# EAGLE design RGBClock (EAGLE 6.5.0)
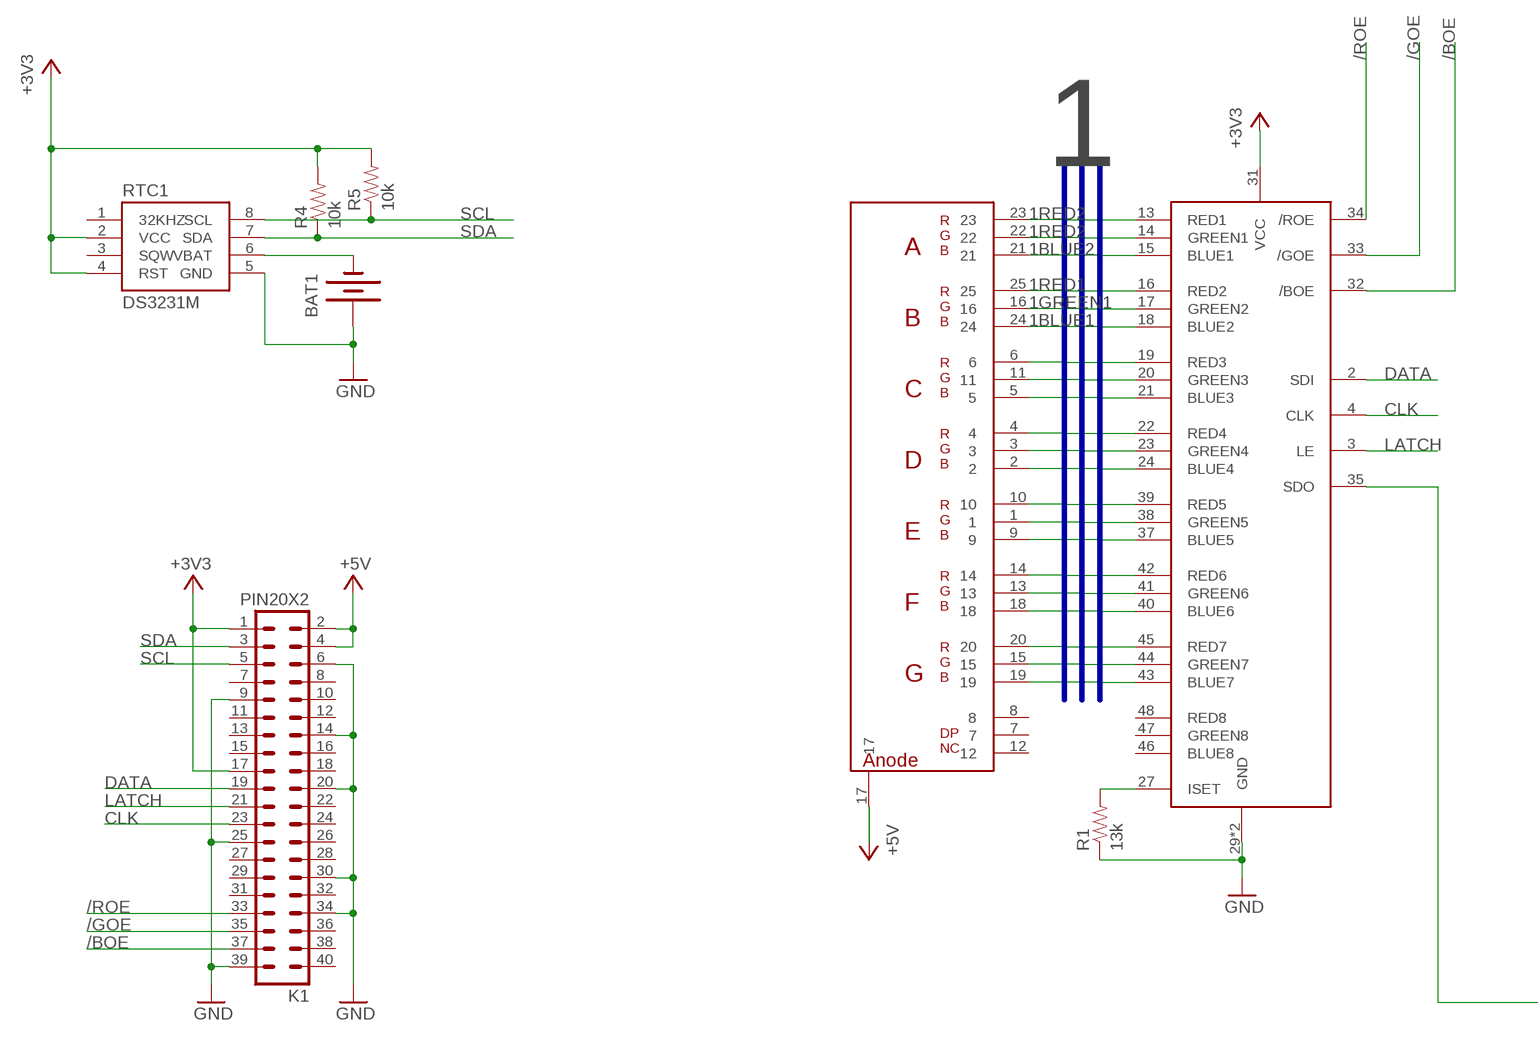
[diagram p0: schematic, sheet 1, part 1 of 2]
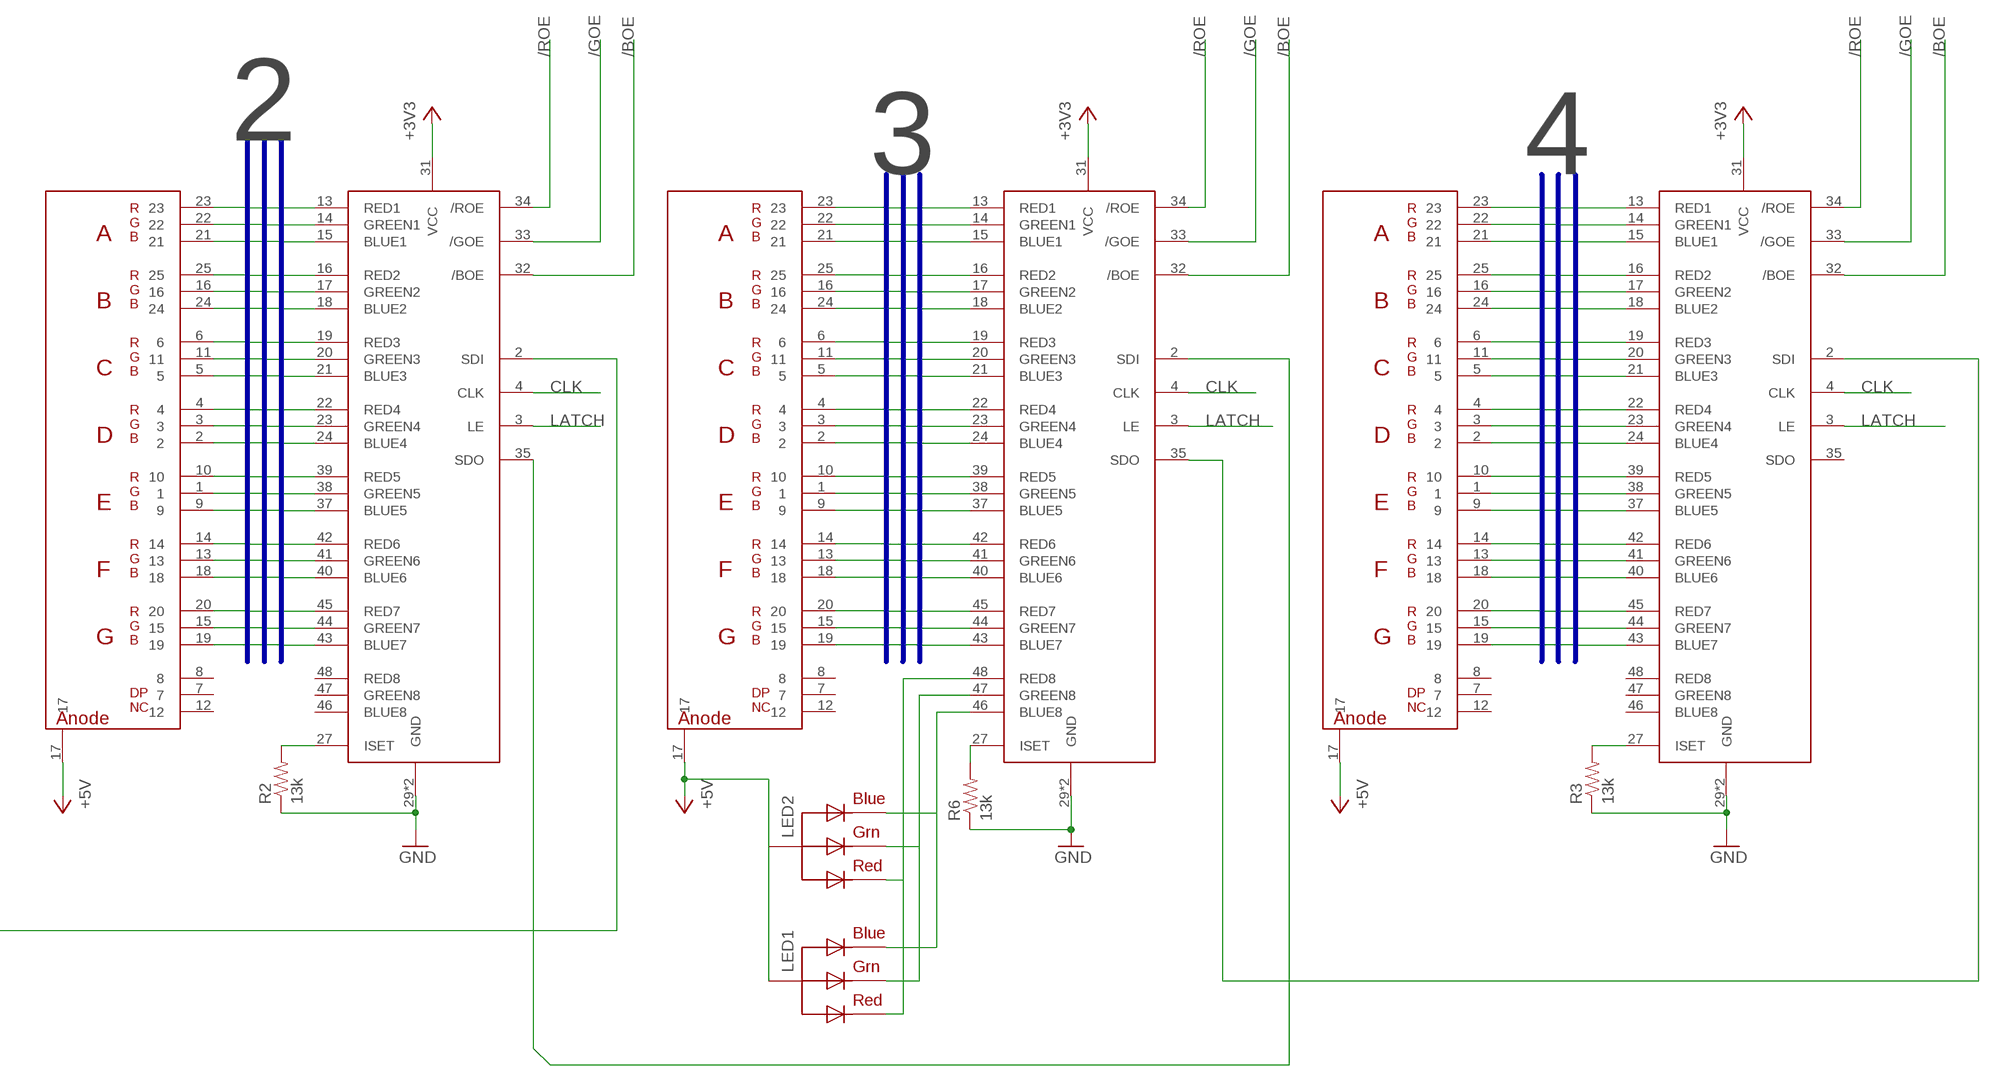
[diagram p1: schematic, sheet 1, part 2 of 2]

## Parts
BAT1  BATTERY12MM  [BATTCON_12MM]
K1  PIN20X2  [PIN_20X2]
LED1  RGBLED_CA-5MM  [LED5MMRGB]
LED2  RGBLED_CA-5MM  [LED5MMRGB]
R1  13k  RESISTOR0805-RES  [0805]
R2  13k  RESISTOR0805-RES  [0805]
R3  13k  RESISTOR0805-RES  [0805]
R4  10k  RESISTOR0805-RES  [0805]
R5  10k  RESISTOR0805-RES  [0805]
R6  13k  RESISTOR0805-RES  [0805]
RTC1  DS3231M  [SOIC8]
U$2  RGBSEVENSEGMENT  [RGBSEVENSEGMENT]
U$3  RGBSEVENSEGMENT  [RGBSEVENSEGMENT]
U$4  RGBSEVENSEGMENT  [RGBSEVENSEGMENT]
U$5  RGBSEVENSEGMENT  [RGBSEVENSEGMENT]
U$6  LED2472G  [TQFP48]
U$7  LED2472G  [TQFP48]
U$8  LED2472G  [TQFP48]
U$9  LED2472G  [TQFP48]

## Nets
1BLUE1: U$2.24 U$6.15(BLUE1)
1BLUE2: U$2.21 U$6.18(BLUE2)
1BLUE3: U$2.19 U$6.21(BLUE3)
1BLUE4: U$2.18 U$6.24(BLUE4)
1BLUE5: U$2.9 U$6.37(BLUE5)
1BLUE6: U$2.2 U$6.40(BLUE6)
1BLUE7: U$2.5 U$6.43(BLUE7)
1GREEN1: U$2.16 U$6.14(GREEN1)
1GREEN2: U$2.22 U$6.17(GREEN2)
1GREEN3: U$2.15 U$6.20(GREEN3)
1GREEN4: U$2.13 U$6.23(GREEN4)
1GREEN5: U$2.1 U$6.38(GREEN5)
1GREEN6: U$2.3 U$6.41(GREEN6)
1GREEN7: U$2.11 U$6.44(GREEN7)
1RED1: U$2.25 U$6.13(RED1)
1RED2: U$2.23 U$6.16(RED2)
1RED3: U$2.20 U$6.19(RED3)
1RED4: U$2.14 U$6.22(RED4)
1RED5: U$2.10 U$6.39(RED5)
1RED6: U$2.4 U$6.42(RED6)
1RED7: U$2.6 U$6.45(RED7)
2BLUE1: U$3.24 U$7.15(BLUE1)
2BLUE2: U$3.21 U$7.18(BLUE2)
2BLUE3: U$3.19 U$7.21(BLUE3)
2BLUE4: U$3.18 U$7.24(BLUE4)
2BLUE5: U$3.9 U$7.37(BLUE5)
2BLUE6: U$3.2 U$7.40(BLUE6)
2BLUE7: U$3.5 U$7.43(BLUE7)
2GREEN1: U$3.16 U$7.14(GREEN1)
2GREEN2: U$3.22 U$7.17(GREEN2)
2GREEN3: U$3.15 U$7.20(GREEN3)
2GREEN4: U$3.13 U$7.23(GREEN4)
2GREEN5: U$3.1 U$7.38(GREEN5)
2GREEN6: U$3.3 U$7.41(GREEN6)
2GREEN7: U$3.11 U$7.44(GREEN7)
2RED1: U$3.25 U$7.13(RED1)
2RED2: U$3.23 U$7.16(RED2)
2RED3: U$3.20 U$7.19(RED3)
2RED4: U$3.14 U$7.22(RED4)
2RED5: U$3.10 U$7.39(RED5)
2RED6: U$3.4 U$7.42(RED6)
2RED7: U$3.6 U$7.45(RED7)
3BLUE1: U$4.24 U$8.15(BLUE1)
3BLUE2: U$4.21 U$8.18(BLUE2)
3BLUE3: U$4.19 U$8.21(BLUE3)
3BLUE4: U$4.18 U$8.24(BLUE4)
3BLUE5: U$4.9 U$8.37(BLUE5)
3BLUE6: U$4.2 U$8.40(BLUE6)
3BLUE7: U$4.5 U$8.43(BLUE7)
3GREEN1: U$4.16 U$8.14(GREEN1)
3GREEN2: U$4.22 U$8.17(GREEN2)
3GREEN3: U$4.15 U$8.20(GREEN3)
3GREEN4: U$4.13 U$8.23(GREEN4)
3GREEN5: U$4.1 U$8.38(GREEN5)
3GREEN6: U$4.3 U$8.41(GREEN6)
3GREEN7: U$4.11 U$8.44(GREEN7)
3RED1: U$4.25 U$8.13(RED1)
3RED2: U$4.23 U$8.16(RED2)
3RED3: U$4.20 U$8.19(RED3)
3RED4: U$4.14 U$8.22(RED4)
3RED5: U$4.10 U$8.39(RED5)
3RED6: U$4.4 U$8.42(RED6)
3RED7: U$4.6 U$8.45(RED7)
4BLUE1: U$5.24 U$9.15(BLUE1)
4BLUE2: U$5.21 U$9.18(BLUE2)
4BLUE3: U$5.19 U$9.21(BLUE3)
4BLUE4: U$5.18 U$9.24(BLUE4)
4BLUE5: U$5.9 U$9.37(BLUE5)
4BLUE6: U$5.2 U$9.40(BLUE6)
4BLUE7: U$5.5 U$9.43(BLUE7)
4GREEN1: U$5.16 U$9.14(GREEN1)
4GREEN2: U$5.22 U$9.17(GREEN2)
4GREEN3: U$5.15 U$9.20(GREEN3)
4GREEN4: U$5.13 U$9.23(GREEN4)
4GREEN5: U$5.1 U$9.38(GREEN5)
4GREEN6: U$5.3 U$9.41(GREEN6)
4GREEN7: U$5.11 U$9.44(GREEN7)
4RED1: U$5.25 U$9.13(RED1)
4RED2: U$5.23 U$9.16(RED2)
4RED3: U$5.20 U$9.19(RED3)
4RED4: U$5.14 U$9.22(RED4)
4RED5: U$5.10 U$9.39(RED5)
4RED6: U$5.4 U$9.42(RED6)
4RED7: U$5.6 U$9.45(RED7)
+3V3: K1.1 K1.17 R4.2 R5.2 RTC1.2(VCC) RTC1.4(RST) U$6.31(VCC) U$7.31(VCC) U$8.31(VCC) U$9.31(VCC)
+5V: K1.2 K1.4 LED1.2(VCC) LED2.2(VCC) U$2.17 U$3.17 U$4.17 U$5.17
/BOE: K1.37 U$6.32(/BOE) U$7.32(/BOE) U$8.32(/BOE) U$9.32(/BOE)
/GOE: K1.35 U$6.33(/GOE) U$7.33(/GOE) U$8.33(/GOE) U$9.33(/GOE)
/ROE: K1.33 U$6.34(/ROE) U$7.34(/ROE) U$8.34(/ROE) U$9.34(/ROE)
CLK: K1.23 U$6.4(CLK) U$7.4(CLK) U$8.4(CLK) U$9.4(CLK)
DATA: K1.19 U$6.2(SDI)
GND: BAT1.PWR@1(+) K1.6 K1.9 K1.14 K1.20 K1.25 K1.30 K1.34 K1.39 R1.1 R2.1 R3.1 R6.1 RTC1.5(GND) U$6.29(GND) U$6.30(GND) U$7.29(GND) U$7.30(GND) U$8.29(GND) U$8.30(GND) U$9.29(GND) U$9.30(GND)
LATCH: K1.21 U$6.3(LE) U$7.3(LE) U$8.3(LE) U$9.3(LE)
N$1: BAT1.GND(-) RTC1.6(VBAT)
N$2: LED1.1(RED) LED2.1(RED) U$8.48(RED8)
N$3: LED1.4(BLUE) LED2.4(BLUE) U$8.46(BLUE8)
N$5: LED1.3(GREEN) LED2.3(GREEN) U$8.47(GREEN8)
N$7: R6.2 U$8.27(ISET)
N$8: R3.2 U$9.27(ISET)
N$9: R2.2 U$7.27(ISET)
N$10: R1.2 U$6.27(ISET)
N$14: U$6.35(SDO) U$7.2(SDI)
N$15: U$7.35(SDO) U$8.2(SDI)
N$16: U$8.35(SDO) U$9.2(SDI)
SCL: K1.5 R5.1 RTC1.8(SCL)
SDA: K1.3 R4.1 RTC1.7(SDA)
Unconnected: K1.7 K1.8 K1.10 K1.11 K1.12 K1.13 K1.15 K1.16 K1.18 K1.22 K1.24 K1.26 K1.27 K1.28 K1.29 K1.31 K1.32 K1.36 K1.38 K1.40 RTC1.1(32KHZ) RTC1.3(SQW) U$2.7 U$2.8 U$2.12 U$3.7 U$3.8 U$3.12 U$4.7 U$4.8 U$4.12 U$5.7 U$5.8 U$5.12 U$6.46(BLUE8) U$6.47(GREEN8) U$6.48(RED8) U$7.46(BLUE8) U$7.47(GREEN8) U$7.48(RED8) U$9.35(SDO) U$9.46(BLUE8) U$9.47(GREEN8) U$9.48(RED8)

## Buses
1RED[1..7]
1GREEN[1..7]
1BLUE[1..7]
2RED[1..7]
2GREEN[1..7]
2BLUE[1..7]
3RED[1..7]
3GREEN[1..7]
3BLUE[1..7]
4RED[1..7]
4GREEN[1..7]
4BLUE[1..7]

## Notes on the sheet
- 1 | 2 | 3 | 4

## Library data of the parts
BAT1 = SparkFun-Electromechanical:BATTERY: Battery Holders Various common sizes : AA, AAA, 18650 (PRT-12895), 20mm coin cell and 12mm coin cell. 20MM_4LEGS, BATT-10373; PROD_ID: BATT-08044
K1 = FLYFISH:PIN20X2
LED1 LED2 = adafruit:RGBLED_CA: RGB LED, common-anode 5MM Staggered pins 5mm Piranha package http://www.ladyada.net/library/pcb/eaglelibrary.html
R1-R6 = SparkFun-Passives:RESISTOR: Resistor Basic schematic elements and footprints for 0603, 1206, and PTH resistors.
RTC1 = SparkFun-DigitalIC:DS3231M: DS3231M Real Time Clock. Accuracy +/-5ppm. Battery Backup. 2.3V to 5.5V.; PROD_ID: IC-11985
U$2-U$5 = Benchoff:RGBSEVENSEGMENT
U$6-U$9 = Benchoff:LED2472G

## Board
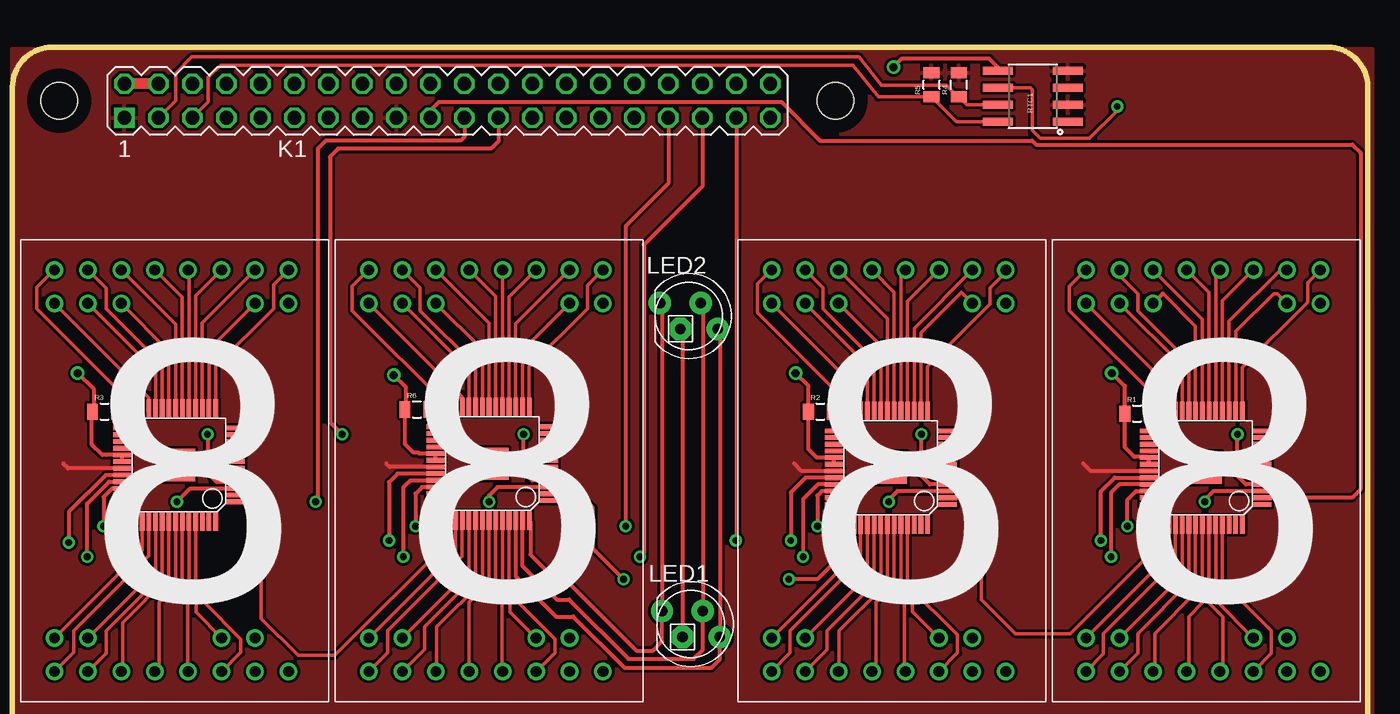
[diagram p2: board, top side]
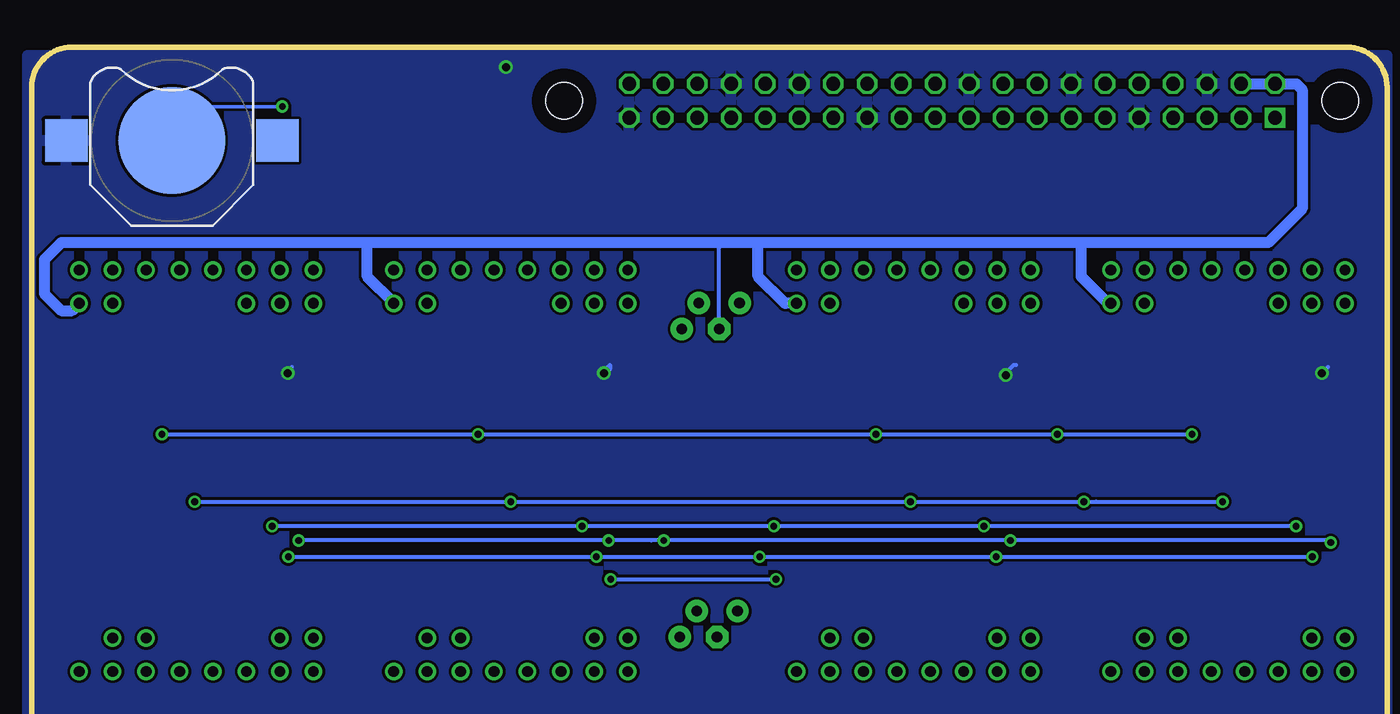
[diagram p3: board, bottom side, seen from below]

No outline drawn. Coordinates in mm, seen from the top.
Copper layers (1*16): Top 0.035mm / dielectric 1.5mm / Bottom 0.035mm
Design rules "default": minimum track width 10mil, minimum drill 24mil, track to track 8mil, track to pad 8mil, pad to pad 8mil, via to via 8mil, smd to smd 8mil, copper to edge 40mil, drill to drill 8mil, minimum pad ring 10mil, minimum via ring 8mil, stop-mask expansion 4mil, vias tented up to drill 0mil, thermal gap 10mil
Holes 2.75 mm at 4.77,3.5 4.77,52.5 62.77,52.5 62.77,3.5
Milling: 8 lines

### Footprints (pad centres in the part's own frame; a part is rotated, then mirrored left to right if it is on the bottom)
BATTCON_12MM = smd 8 x 8: GND 0,0 | smd 3.175 x 3.175: PWR@1 -7.874,0; PWR@2 7.874,0
PIN_20X2 = drill 1.016 square: 1 -24.13,-1.27 | drill 1.016 octagon: 2 -24.13,1.27; 3 -21.59,-1.27; 4 -21.59,1.27; 5 -19.05,-1.27; 6 -19.05,1.27; 7 -16.51,-1.27; 8 -16.51,1.27; 9 -13.97,-1.27; 10 -13.97,1.27; 11 -11.43,-1.27; 12 -11.43,1.27; 13 -8.89,-1.27; 14 -8.89,1.27; 15 -6.35,-1.27; 16 -6.35,1.27; 17 -3.81,-1.27; 18 -3.81,1.27; 19 -1.27,-1.27; 20 -1.27,1.27; 21 1.27,-1.27; 22 1.27,1.27; 23 3.81,-1.27; 24 3.81,1.27; 25 6.35,-1.27; 26 6.35,1.27; 27 8.89,-1.27; 28 8.89,1.27; 29 11.43,-1.27; 30 11.43,1.27; 31 13.97,-1.27; 32 13.97,1.27; 33 16.51,-1.27; 34 16.51,1.27; 35 19.05,-1.27; 36 19.05,1.27; 37 21.59,-1.27; 38 21.59,1.27; 39 24.13,-1.27; 40 24.13,1.27
LED5MMRGB = drill 0.8 pad 1.676: 1 -2.159,0.968; 3 0.889,0.968; 4 2.159,-0.968 | drill 0.8 pad 1.676 octagon: 2 -0.635,-0.968
0805 = smd 0.8 x 1.2: 1 -0.9,0; 2 0.9,0
SOIC8 = smd 0.61 x 2.21: 1 -1.905,-2.616; 2 -0.635,-2.616; 3 0.635,-2.616; 4 1.905,-2.616; 5 1.905,2.616; 6 0.635,2.616; 7 -0.635,2.616; 8 -1.905,2.616
RGBSEVENSEGMENT = drill 0.8: 1 2.5,2.25; 2 5,2.25; 3 7.5,2.25; 4 10,2.25; 5 12.5,2.25; 6 15,2.25; 7 17.5,2.25; 8 20,2.25; 9 2.5,4.75; 10 5,4.75; 11 15,4.75; 12 17.5,4.75; 13 2.5,29.75; 14 5,29.75; 15 7.5,29.75; 16 17.5,29.75; 17 20,29.75; 18 2.5,32.25; 19 5,32.25; 20 7.5,32.25; 21 10,32.25; 22 12.5,32.25; 23 15,32.25; 24 17.5,32.25; 25 20,32.25
TQFP48 = smd 0.35 x 1.35: 1 -2.75,-4.25; 2 -2.25,-4.25; 3 -1.75,-4.25; 4 -1.25,-4.25; 5 -0.75,-4.25; 6 -0.25,-4.25; 7 0.25,-4.25; 8 0.75,-4.25; 9 1.25,-4.25; 10 1.75,-4.25; 11 2.25,-4.25; 12 2.75,-4.25; 25 2.75,4.25; 26 2.25,4.25; 27 1.75,4.25; 28 1.25,4.25; 29 0.75,4.25; 30 0.25,4.25; 31 -0.25,4.25; 32 -0.75,4.25; 33 -1.25,4.25; 34 -1.75,4.25; 35 -2.25,4.25; 36 -2.75,4.25 | smd 1.35 x 0.35: 13 4.25,-2.75; 14 4.25,-2.25; 15 4.25,-1.75; 16 4.25,-1.25; 17 4.25,-0.75; 18 4.25,-0.25; 19 4.25,0.25; 20 4.25,0.75; 21 4.25,1.25; 22 4.25,1.75; 23 4.25,2.25; 24 4.25,2.75; 37 -4.25,2.75; 38 -4.25,2.25; 39 -4.25,1.75; 40 -4.25,1.25; 41 -4.25,0.75; 42 -4.25,0.25; 43 -4.25,-0.25; 44 -4.25,-0.75; 45 -4.25,-1.25; 46 -4.25,-1.75; 47 -4.25,-2.25; 48 -4.25,-2.75 | smd 2.4 x 2.4: PAD 0,0

### Placement (x,y rotation side)
BAT1  92.08,49.53 0 bottom
K1  33.77,52.5 0 top
LED1  51.97,13.41 0 top
LED2  51.82,36.42 0 top
R1  85.29,29.13 0 top
R2  61.65,29.29 0 top
R3  8.15,29.29 0 top
R4  71.98,53.7 90 top
R5  69.95,53.7 90 top
R6  31.5,29.44 0 top
RTC1  77.52,52.83 90 top
U$2  78.99,7.62 0 top
U$3  55.5,7.62 0 top
U$4  25.4,7.62 0 top
U$5  1.91,7.62 0 top
U$6  90.42,25.1 90 top
U$7  66.9,25.1 90 top
U$8  37.13,25.4 90 top
U$9  13.72,25.3 90 top

### Tracks (layer width: path | path; a pad name or v marks a point on that pad's centre or on a via)
1BLUE1
  Top 0.254: U$6.15 92.17,36.04 96.14,40.01 96.36,40.01 U$2.24
1BLUE2
  Top 0.254: U$6.18 90.67,38.19 U$2.21
1BLUE3
  Top 0.254: U$2.19 83.99,39.45 85.34,38.1 85.34,36.83 89.15,33.02 89.15,29.67 U$6.21
1BLUE4
  Top 0.254: U$6.24 87.44,29.65 80.26,36.83 80.26,38.64 U$2.18
1BLUE5
  Top 0.254: U$6.37 87.67,18.55 U$2.9
1BLUE6
  Top 0.254: U$6.40 89.17,16.53 85.34,12.7 85.34,11.22 U$2.2
1BLUE7
  Top 0.254: U$6.43 90.67,14.99 91.69,13.97 91.69,10.07 U$2.5
1GREEN1
  Top 0.254: U$6.14 92.67,35.27 95.5,38.1 95.76,38.1 U$2.16
1GREEN2
  Top 0.254: U$6.17 91.17,39.55 U$2.22
1GREEN3
  Top 0.254: U$6.20 89.67,35.67 87.25,38.1
  Top 0.305: 87.25,38.1 87.22,38.1 U$2.15
1GREEN4
  Top 0.254: U$6.23 88.17,30.69 U$2.13
1GREEN5
  Top 0.254: U$6.38 88.17,18.07 82.8,12.7 82.8,11.18 U$2.1
1GREEN6
  Top 0.254: U$6.41 89.67,15.76 86.61,12.7 86.61,9.99 U$2.3
1GREEN7
  Top 0.254: U$6.44 91.17,15.19 U$2.11
1RED1
  Top 0.254: U$6.13 93.17,32.59 98.04,37.47 98.04,38.92 U$2.25
1RED2
  Top 0.254: U$6.16 91.67,37.55 U$2.23
1RED3
  Top 0.254: U$6.19 90.17,36.19 U$2.20
1RED4
  Top 0.254: U$6.22 88.67,32.69 U$2.14
1RED5
  Top 0.254: U$6.39 88.67,17.05 U$2.10
1RED6
  Top 0.254: U$6.42 90.17,14.99 89.15,13.97 89.15,10.03 U$2.4
1RED7
  Top 0.254: U$6.45 91.67,16.58 95.35,12.9 95.35,11.23 U$2.6
2BLUE1
  Top 0.254: U$3.24 68.65,35.52 U$7.15
2BLUE2
  Top 0.254: U$3.21 67.15,38.22 U$7.18
2BLUE3
  Top 0.254: U$3.19 61.82,38.55 61.82,36.98 65.65,33.15 U$7.21
2BLUE4
  Top 0.254: U$3.18 56.95,38.82 56.95,36.68 64.15,29.47 U$7.24
2BLUE5
  Top 0.254: U$3.9 64.15,18.52 U$7.37
2BLUE6
  Top 0.254: U$3.2 62.13,11.5 62.13,12.9 65.65,16.43 U$7.40
2BLUE7
  Top 0.254: U$3.5 67.92,9.95 67.92,15.04 67.15,15.8 U$7.43
2GREEN1
  Top 0.254: U$7.14 69.15,35.17 72.19,38.2 72.19,38.18 U$3.16
2GREEN2
  Top 0.254: U$3.22 67.65,39.52 U$7.17
2GREEN3
  Top 0.254: U$3.15 66.15,34.22 U$7.20
2GREEN4
  Top 0.254: U$3.13 64.65,30.71 U$7.23
2GREEN5
  Top 0.254: U$3.1 59.38,11.26 59.38,12.9 64.65,18.17 U$7.38
2GREEN6
  Top 0.254: U$3.3 63.04,9.91 63.04,12.9 66.15,16.01 U$7.41
2GREEN7
  Top 0.254: U$3.11 68.53,14.34 68.53,15.04 67.65,15.91 U$7.44
2RED1
  Top 0.254: U$3.25 75.5,39.69 74.32,38.51 74.32,37.29 69.65,32.62 U$7.13
2RED2
  Top 0.254: U$3.23 68.15,37.52 U$7.16
2RED3
  Top 0.254: U$3.20 66.65,36.22 U$7.19
2RED4
  Top 0.254: U$3.14 65.15,32.72 U$7.22
2RED5
  Top 0.254: U$3.10 65.15,17.02 U$7.39
2RED6
  Top 0.254: U$3.4 65.79,10.16 65.79,15.04 66.65,15.9 U$7.42
2RED7
  Top 0.254: U$3.6 71.88,11.25 71.88,12.6 68.15,16.33 U$7.45
3BLUE1
  Top 0.254: U$4.24 38.88,35.85 U$8.15
3BLUE2
  Top 0.254: U$4.21 37.38,37.88 U$8.18
3BLUE3
  Top 0.254: U$4.19 31.75,38.52 31.75,36.83 35.88,32.7 U$8.21
3BLUE4
  Top 0.254: U$4.18 26.67,38.64 26.67,36.83 33.85,29.65 U$8.24
3BLUE5
  Top 0.254: U$4.9 34.38,18.86 U$8.37
3BLUE6
  Top 0.254: U$4.2 32.05,11.53 32.05,13.21 35.88,17.04 U$8.40
3BLUE7
  Top 0.254: U$4.5 37.85,9.92 37.85,15.95 37.38,16.41 U$8.43
3GREEN1
  Top 0.254: U$4.16 39.38,33.85 U$8.14
3GREEN2
  Top 0.254: U$4.22 37.88,39.85 U$8.17
3GREEN3
  Top 0.254: U$4.15 36.38,33.88 U$8.20
3GREEN4
  Top 0.254: U$4.13 34.88,30.39 U$8.23
3GREEN5
  Top 0.254: U$4.1 29.31,11.28 29.31,12.9 34.88,18.48 U$8.38
3GREEN6
  Top 0.254: U$4.3 32.97,9.94 32.97,13.21 36.38,16.62 U$8.41
3GREEN7
  Top 0.254: U$4.11 38.46,14.31 38.46,15.95 37.88,16.52 U$8.44
3RED1
  Top 0.254: U$4.25 44.25,38.72 44.25,36.98 39.88,32.62 U$8.13
3RED2
  Top 0.254: U$4.23 38.38,37.85 U$8.16
3RED3
  Top 0.254: U$4.20 36.88,35.88 U$8.19
3RED4
  Top 0.254: U$4.14 35.38,32.38 U$8.22
3RED5
  Top 0.254: U$4.10 35.38,17.36 U$8.39
3RED6
  Top 0.254: U$4.4 arc90 U$4.4 35.41,15.04 36.88,16.51 U$8.42
3RED7
  Top 0.254: U$4.6 41.81,11.28 41.81,12.29 39.06,15.04 39.06,15.95 38.38,16.63 U$8.45
4BLUE1
  Top 0.254: U$5.24 15.47,35.93 U$9.15
4BLUE2
  Top 0.254: U$5.21 13.97,37.81 U$9.18
4BLUE3
  Top 0.254: U$5.19 8.28,38.49 8.28,36.98 12.47,32.8 U$9.21
4BLUE4
  Top 0.254: U$5.18 3.1,38.56 3.1,36.98 10.53,29.55 U$9.24
4BLUE5
  Top 0.254: U$5.9 10.97,18.93 U$9.37
4BLUE6
  Top 0.254: U$5.2 8.28,11.24 8.28,12.9 12.47,17.09 U$9.40
4BLUE7
  Top 0.254: U$5.5 14.38,9.9 14.38,15.65 13.97,16.06 U$9.43
4GREEN1
  Top 0.254: U$5.16 15.97,33.93 U$9.14
4GREEN2
  Top 0.254: U$5.22 14.47,39.81 U$9.17
4GREEN3
  Top 0.254: U$5.15 12.97,33.81 U$9.20
4GREEN4
  Top 0.254: U$5.13 11.47,30.31 U$9.23
4GREEN5
  Top 0.254: U$5.1 5.84,11.31 5.84,12.9 11.47,18.53 U$9.38
4GREEN6
  Top 0.254: U$5.3 9.5,9.96 9.5,13.51 12.97,16.98 U$9.41
4GREEN7
  Top 0.254: U$5.11 14.99,14.29 14.99,15.65 14.47,16.17 U$9.44
4RED1
  Top 0.254: U$5.25 20.78,38.74 20.78,36.98 16.47,32.67 U$9.13
4RED2
  Top 0.254: U$5.23 14.97,37.93 U$9.16
4RED3
  Top 0.254: U$5.20 13.47,35.81 U$9.19
4RED4
  Top 0.254: U$5.14 11.97,32.31 U$9.22
4RED5
  Top 0.254: U$5.10 11.97,17.43 U$9.39
4RED6
  Top 0.254: U$5.4 12.24,10.21 12.24,15.04 13.47,16.26 U$9.42
4RED7
  Top 0.254: U$5.6 18.34,11.3 18.34,12.29 15.6,15.04 15.6,15.65 14.97,16.28 U$9.45
+3V3
  Top 0.305: U$7.31 60.24,24.84 59.69,25.4 | U$8.31 29.46,25.15 29.21,25.4 | U$9.31 5.43,25.05 5.08,25.4 | U$6.31 81.83,24.84 81.28,25.4
  pour Top: 1.27,0 1.27,56.39 102.87,56.39 102.87,0
+5V
  Top 0.305: LED2.2 51.33,35.3 LED1.2
  Top 0.813: K1.4 K1.2
  Bottom 0.305: LED2.2 51.18,41.53 50.8,41.91
  Bottom 0.813: K1.4 8.05,53.77 7.62,53.34 7.62,44.45 10.16,41.91 24.13,41.91 | 24.13,41.91 48.26,41.91 | 48.26,41.91 50.8,41.91 77.47,41.91 | 77.47,41.91 100.33,41.91 101.6,40.64 101.6,38.1 100.33,36.83 99.53,36.83 U$2.17 | U$3.17 75.5,37.4 77.47,39.37 77.47,41.91 | U$4.17 46.26,37.37 48.26,39.37 48.26,41.91 | U$5.17 22.13,37.37 24.13,39.37 24.13,41.91
/BOE  (via drill 0.5)
  Top 0.305: U$9.32 9.45,24.54 8.23,24.54 5.49,21.79 v5.49,19.51 | v82.6,19.66 82.6,23.32 83.63,24.34 U$6.32 | U$8.32 30.05,24.65 29.41,24.02 v29.41,19.66 | U$7.32 60.53,24.34 59.44,23.25 v59.44,19.66 | K1.37 55.36,19.7 v55.32,19.66
  Bottom 0.305: v5.49,19.51 5.64,19.66 v29.41,19.66 v55.32,19.66 56.24,19.66 v59.44,19.66 v82.6,19.66
/GOE  (via drill 0.5)
  Top 0.305: U$6.33 84,23.84 83.36,23.21 v83.36,18.44 | v6.86,18.44 6.86,22.4 8.5,24.05 U$9.33 | U$8.33 32.87,24.13 30.99,24.13 30.48,23.62 v30.48,18.44 | U$7.33 61.44,23.84 60.35,22.75 v60.35,18.44 | K1.35 52.82,46.11 48.46,41.76 48.46,18.75 v48.16,18.44
  Bottom 0.305: v83.36,18.44 v60.35,18.44 v48.16,18.44 47.24,18.44 v30.48,18.44 v6.86,18.44
/ROE  (via drill 0.5)
  Top 0.305: U$9.34 8.71,23.55 8.08,22.91 v8.08,20.73 | v84.58,20.73 84.58,22.71 85.22,23.34 U$6.34 | U$7.34 61.75,23.34 61.42,23.01 v61.42,20.73 | U$8.34 31.88,23.65 31.39,23.16 v31.39,20.73 | K1.33 50.29,51.22 50.29,46.33 47.09,43.13 v47.09,20.73
  Bottom 0.305: v8.08,20.73 v31.39,20.73 46.63,20.73 v47.09,20.73 v61.42,20.73 v84.58,20.73
CLK  (via drill 0.5)
  Top 0.305: U$6.4 93.45,23.84 92.81,24.48 v92.81,27.58 | v15.85,27.58 15.85,24.68 16.48,24.05 U$9.4 | U$8.4 40.11,24.15 39.47,24.79 v39.47,27.58 | U$7.4 69.83,23.84 69.19,24.48 v69.19,27.58 | K1.23 37.58,49.47 37.03,48.92 25.6,48.92 24.99,48.31 24.99,28.5 v25.91,27.58
  Bottom 0.305: v92.81,27.58 v69.19,27.58 v39.47,27.58 26.36,27.58 v25.91,27.58 v15.85,27.58
DATA
  Top 0.305: K1.19 32.5,51.79 33.13,52.43 58.73,52.43 61.62,49.53 77.47,49.53 77.78,49.23 101.4,49.23 102.01,48.62 102.01,23.47 101.4,22.86 94.69,22.86 U$6.2
GND  (via drill 0.6)
  Top 0.305: U$9.30 U$9.29 | U$8.30 U$8.29 31.66,26.15 31.6,26.21 31.23,26.21 30.6,26.85 R6.1 30.6,29.48 30.68,29.57 30.68,31.09 v29.77,32 | U$7.30 U$7.29 61.38,25.84 60.75,26.48 R2.1 60.75,31.2 v59.79,32.16 | U$6.30 U$6.29 86.11,25.91 85.09,25.91 84.39,26.61 R1.1 84.39,31.18 v83.41,32.16 | RTC1.5 74.91,54.99 74.27,55.63 67.72,55.63 v67.11,55.02 | U$9.29 8.29,26.05 8.28,26.06 7.98,26.06 | 7.21,29.11 7.21,29.25 R3.1 | U$9.29 7.99,26.05 7.98,26.06 | 7.98,26.06 7.21,26.82 7.21,29.11 | 7.21,29.11 7.37,29.26 7.37,30.94 v6.15,32.16
  Bottom 0.305: v67.11,55.02 67.11,54.71 | v6.15,32.16 5.69,32.61 | v29.77,32 29.77,32.16 29.16,32.77 29.01,32.77 | v59.79,32.16 59.79,32.31 59.33,32.77 59.33,32.46 59.49,32.31 | v83.41,32.16 83.41,32.31 83.11,32.61
  pour Bottom: 1.27,0 1.27,55.88 102.87,55.88 102.87,0
LATCH  (via drill 0.5)
  Top 0.305: U$6.3 91.01,23.34 90.37,22.71 v90.37,22.55 | v13.56,22.55 14.56,23.55 U$9.3 | U$8.3 37.52,23.65 36.88,23.02 v36.88,22.55 | U$7.3 67.39,23.34 66.75,22.71 v66.75,22.55 | K1.21 35.04,49.82 34.75,49.53 24.69,49.53 24.08,48.92 24.08,22.71 v23.93,22.55
  Bottom 0.305: v90.37,22.55 v66.75,22.55 v36.88,22.55 v23.93,22.55 23.01,22.55 v13.56,22.55
N$1  (via drill 0.5)
  Top 0.254: 83.74,51.99 v83.82,52.07 83.82,51.77 81.74,49.68 78.08,49.68 77.47,50.29 77.47,53.34 77.34,53.47 RTC1.6
  Bottom 0.254: v83.82,52.07 89.53,52.07 BAT1.GND
N$2
  Top 0.305: U$8.48 39.98,21.05 39.98,18.59 41.81,16.76 42.57,16.76 47.9,11.43 49.12,11.43 49.81,12.12 LED1.1 49.81,37.24 LED2.1
N$3
  Top 0.305: U$8.46 38.88,17 41.91,13.97 43.18,13.97 46.99,10.16 53.49,10.16 54.13,10.79 LED1.4 54.13,35.3 LED2.4
N$5
  Top 0.254: U$8.47
  Top 0.305: U$8.47 39.37,21.14 39.37,17.78 41.96,15.24 42.88,15.24 47.3,10.82 52.17,10.82 52.86,11.51 LED1.3 52.86,37.24 LED2.3
N$7
  Top 0.305: U$8.27 33.75,27.15 34.04,27.43 34.04,28.5 33.12,29.41 32.42,29.41 R6.2
N$8
  Top 0.305: U$9.27 10.49,27.05 10.72,27.28 10.72,28.35 9.8,29.26 9.08,29.26 R3.2
N$9
  Top 0.305: U$7.27 62.68,26.82 63.45,26.82 63.75,27.13 63.75,28.19 62.66,29.29 R2.2
N$10
  Top 0.305: U$6.27 87.09,26.84 87.38,27.13 87.38,28.19 86.44,29.13 R1.2
N$14
  Top 0.254: U$7.2 72.38,22.84 72.39,22.86 73.03,22.86 73.66,22.23 73.66,15.24 76.2,12.7 80.31,12.7 87.22,19.61 87.22,22.96 U$6.35
N$15  (via drill 0.5)
  Top 0.305: U$7.35 63.54,22.84 63.55,22.86 63.7,22.71 63.7,21.95 63.09,21.34 63.09,18.44 61.42,16.76 v59.28,16.76 | v46.94,16.76 44.65,19.05 44.65,22.1 43.6,23.15 U$8.2
  Bottom 0.305: v59.28,16.76 v46.94,16.76
N$16
  Top 0.254: 32.78,23.05 U$8.35 33,23.27 33.88,23.27 33.88,19.61 25.35,11.07 22.61,11.07 19.86,13.82 19.86,22.05 18.86,23.05 U$9.2
SCL
  Top 0.254: RTC1.8 71.82,50.93 R5.1 65.97,52.8 64.06,55.17 16.82,55.17 15.9,54.25 15.9,52.41 K1.5
SDA
  Top 0.254: RTC1.7 72.58,52.2 R4.1 71.92,52.8 71.07,53.65 66.19,53.65 64.52,55.78 14.68,55.78 13.46,54.56 13.46,52.51 K1.3